# Altium project ThermalTiny.PrjPcb
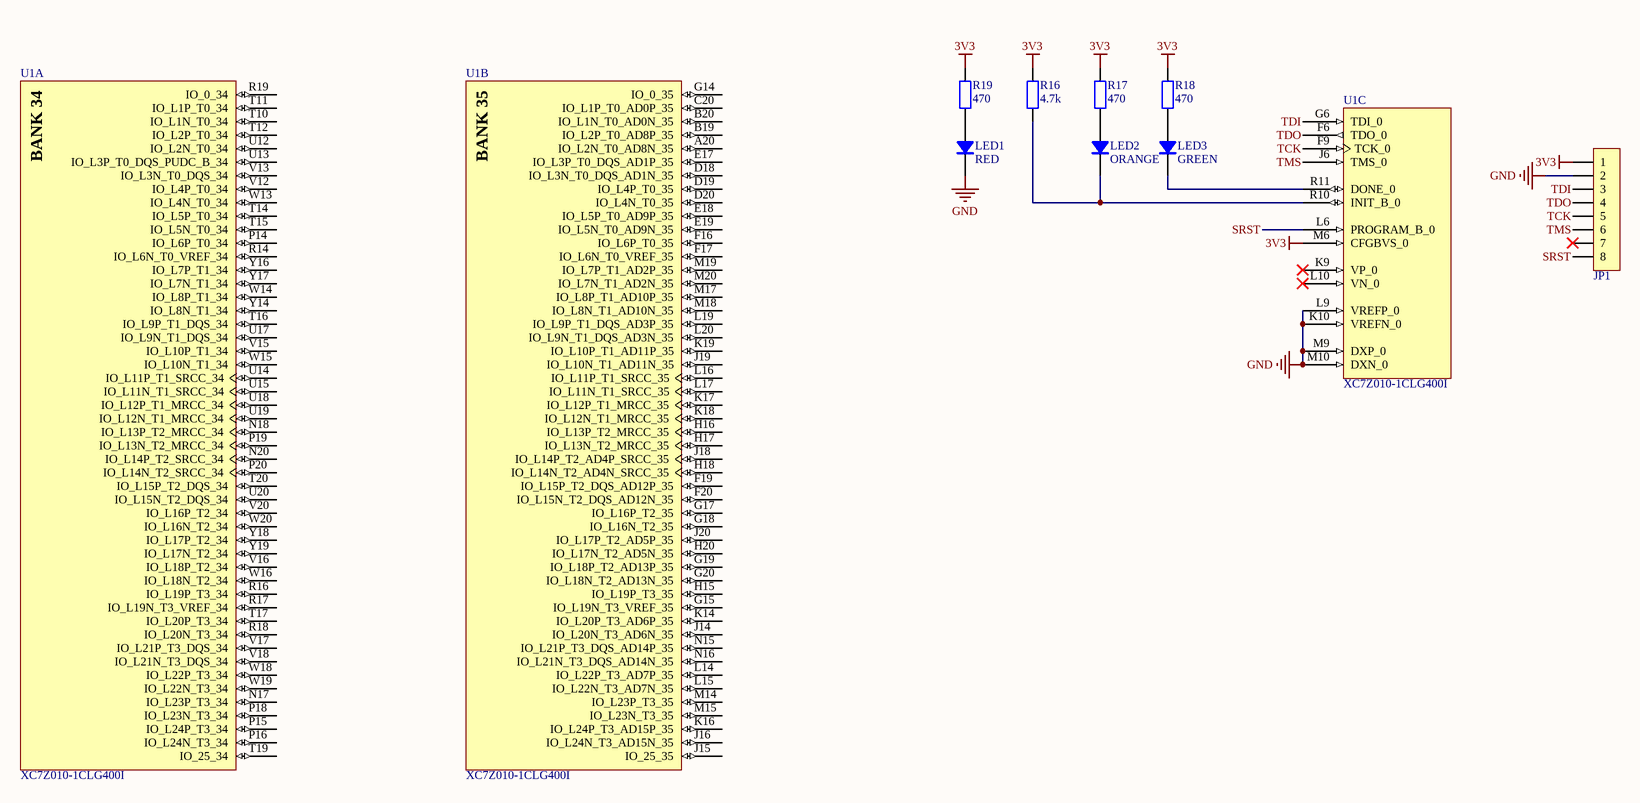
[diagram p0: FPGA_Banks.SchDoc]
5 sheets, 78 parts. Net scope: global (net labels, ports and power ports of the same name join across sheets).
Board file: PCB3.PcbDoc
Sheets:
  FPGA_Banks.SchDoc
  FPGA_PowerConnection.SchDoc
  FPGA_PSIO.SchDoc
  Power_Supply.SchDoc
  Data_Collector.SchDoc

## Sheet FPGA_Banks.SchDoc
size A3; SheetNumber: 1; SheetTotal: 5

### Parts
JP1  HDR-1X8  [HDR2.54-LI-8P]  (value not drawn)
LED1  RED  [LED 0603R]
LED2  ORANGE  [LED 0603Y]
LED3  GREEN  [LED 0603G]
R16  4.7k  [R0402]
R17  470  [R0402]
R18  470  [R0402]
R19  470  [R0402]
U1  XC7Z010-1CLG400I  [CLG400]  (parts A,B,C of 9)

### Nets
3V3: JP1.1 R16.1 R17.1 R18.1 R19.1 U1.M6(CFGBVS_0)
GND: JP1.2 LED1.2(K) U1.K10(VREFN_0) U1.L9(VREFP_0) U1.M9(DXP_0) U1.M10(DXN_0)
SRST: JP1.8 U1.L6(PROGRAM_B_0)
TCK: JP1.5 U1.F9(TCK_0)
TDI: JP1.3 U1.G6(TDI_0)
TDO: JP1.4 U1.F6(TDO_0)
TMS: JP1.6 U1.J6(TMS_0)
NetLED1_1: LED1.1(A) R19.2
NetLED2_1: LED2.1(A) R17.2
NetLED2_2: LED2.2(K) R16.2 U1.R10(INIT_B_0)
NetLED3_1: LED3.1(A) R18.2
NetLED3_2: LED3.2(K) U1.R11(DONE_0)

Not connected (* = marked no-connect by the designer): JP1 7*; U1 A20(IO_L2N_T0_AD8N_35) B19(IO_L2P_T0_AD8P_35) B20(IO_L1N_T0_AD0N_35) C20(IO_L1P_T0_AD0P_35) D18(IO_L3N_T0_DQS_AD1N_35) D19(IO_L4P_T0_35) D20(IO_L4N_T0_35) E17(IO_L3P_T0_DQS_AD1P_35) E18(IO_L5P_T0_AD9P_35) E19(IO_L5N_T0_AD9N_35) F16(IO_L6P_T0_35) F17(IO_L6N_T0_VREF_35) F19(IO_L15P_T2_DQS_AD12P_35) F20(IO_L15N_T2_DQS_AD12N_35) G14(IO_0_35) G15(IO_L19N_T3_VREF_35) G17(IO_L16P_T2_35) G18(IO_L16N_T2_35) G19(IO_L18P_T2_AD13P_35) G20(IO_L18N_T2_AD13N_35) H15(IO_L19P_T3_35) H16(IO_L13P_T2_MRCC_35) H17(IO_L13N_T2_MRCC_35) H18(IO_L14N_T2_AD4N_SRCC_35) H20(IO_L17N_T2_AD5N_35) J14(IO_L20N_T3_AD6N_35) J15(IO_25_35) J16(IO_L24N_T3_AD15N_35) J18(IO_L14P_T2_AD4P_SRCC_35) J19(IO_L10N_T1_AD11N_35) J20(IO_L17P_T2_AD5P_35) K9(VP_0)* K14(IO_L20P_T3_AD6P_35) K16(IO_L24P_T3_AD15P_35) K17(IO_L12P_T1_MRCC_35) K18(IO_L12N_T1_MRCC_35) K19(IO_L10P_T1_AD11P_35) L10(VN_0)* L14(IO_L22P_T3_AD7P_35) L15(IO_L22N_T3_AD7N_35) L16(IO_L11P_T1_SRCC_35) L17(IO_L11N_T1_SRCC_35) L19(IO_L9P_T1_DQS_AD3P_35) L20(IO_L9N_T1_DQS_AD3N_35) M14(IO_L23P_T3_35) M15(IO_L23N_T3_35) M17(IO_L8P_T1_AD10P_35) M18(IO_L8N_T1_AD10N_35) M19(IO_L7P_T1_AD2P_35) M20(IO_L7N_T1_AD2N_35) N15(IO_L21P_T3_DQS_AD14P_35) N16(IO_L21N_T3_DQS_AD14N_35) N17(IO_L23P_T3_34) N18(IO_L13P_T2_MRCC_34) N20(IO_L14P_T2_SRCC_34) P14(IO_L6P_T0_34) P15(IO_L24P_T3_34) P16(IO_L24N_T3_34) P18(IO_L23N_T3_34) P19(IO_L13N_T2_MRCC_34) P20(IO_L14N_T2_SRCC_34) R14(IO_L6N_T0_VREF_34) R16(IO_L19P_T3_34) R17(IO_L19N_T3_VREF_34) R18(IO_L20N_T3_34) R19(IO_0_34) T10(IO_L1N_T0_34) T11(IO_L1P_T0_34) T12(IO_L2P_T0_34) T14(IO_L5P_T0_34) T15(IO_L5N_T0_34) T16(IO_L9P_T1_DQS_34) T17(IO_L20P_T3_34) T19(IO_25_34) T20(IO_L15P_T2_DQS_34) U12(IO_L2N_T0_34) U13(IO_L3P_T0_DQS_PUDC_B_34) U14(IO_L11P_T1_SRCC_34) U15(IO_L11N_T1_SRCC_34) U17(IO_L9N_T1_DQS_34) U18(IO_L12P_T1_MRCC_34) U19(IO_L12N_T1_MRCC_34) U20(IO_L15N_T2_DQS_34) V12(IO_L4P_T0_34) V13(IO_L3N_T0_DQS_34) V15(IO_L10P_T1_34) V16(IO_L18P_T2_34) V17(IO_L21P_T3_DQS_34) V18(IO_L21N_T3_DQS_34) V20(IO_L16P_T2_34) W13(IO_L4N_T0_34) W14(IO_L8P_T1_34) W15(IO_L10N_T1_34) W16(IO_L18N_T2_34) W18(IO_L22P_T3_34) W19(IO_L22N_T3_34) W20(IO_L16N_T2_34) Y14(IO_L8N_T1_34) Y16(IO_L7P_T1_34) Y17(IO_L7N_T1_34) Y18(IO_L17P_T2_34) Y19(IO_L17N_T2_34)

### Notes on the sheet
- (in symbol CMP-0363-00008-3, part A) BANK 34
- (in symbol CMP-0363-00008-3, part B) BANK 35

### Library data of the parts
JP1 = Header 8: 8P接插件; 版权归属: 源创客; BOM名称: 8P接插件; 学习资源: www.ooocke.com
LED1-LED3 = D
R16-R19 = R
U1 = CMP-0363-00008-3: 667 MHz Zynq™-7000 AP SoC, 130 PS I/O, 100 FPGA I/O, 400-Ball BGA, Speed Grade 1, Industrial Grade, Pb-Free; Speed Grade: -1; LUTs: 17600; Extensible Block RAM (# 36Kb Blocks): 240 KB (60); Flip Flops: 35200; PartNumber: XC7Z010-1CLG400I; Mounting Technology: Surface Mount; ComponentLink5URL: http://www.xilinx.com/support/documentation/user_guides/ug865-Zynq-7000-Pkg-Pinout.pdf; ComponentLink3URL: http://www.xilinx.com/support/documentation/data_sheets/ds187-XC7Z010-XC7Z020-Data-Sheet.pdf; PackageVersion: Rev 1.1, 09/2012; ComponentLink2Description: Package Specification; ComponentLink4Description: Package File; ComponentLink2URL: http://www.xilinx.com/support/documentation/user_guides/ug865-Zynq-7000-Pkg-Pinout.pdf; ComponentLink3Description: DC and AC Switching Characteristics; ComponentLink6Description: PCB and Layout Guide; ComponentLink4URL: http://www.xilinx.com/support/packagefiles/z7packages/xc7z010clg400pkg.txt; ComponentLink1URL: http://www.xilinx.com/support/documentation/data_sheets/ds190-Zynq-7000-Overview.pdf; Generic Part Number: XC7Z010; PackageReference: CLG400; ComponentLink1Description: Datasheet; RoHS: Pb-Free; ComponentLink6URL: http://www.xilinx.com/support/documentation/user_guides/ug483_7Series_PCB.pdf; DatasheetVersion: v1.2; PackageDescription: Wire-Bond Chip-Scale BGA, Body 17 x 17 mm, 0.8 mm Pitch; ComponentLink5Description: Packaging and Pinout; Code_JEDEC: MO-275-MMAA-1

## Sheet FPGA_PowerConnection.SchDoc
size A3; SheetNumber: 2; SheetTotal: 5
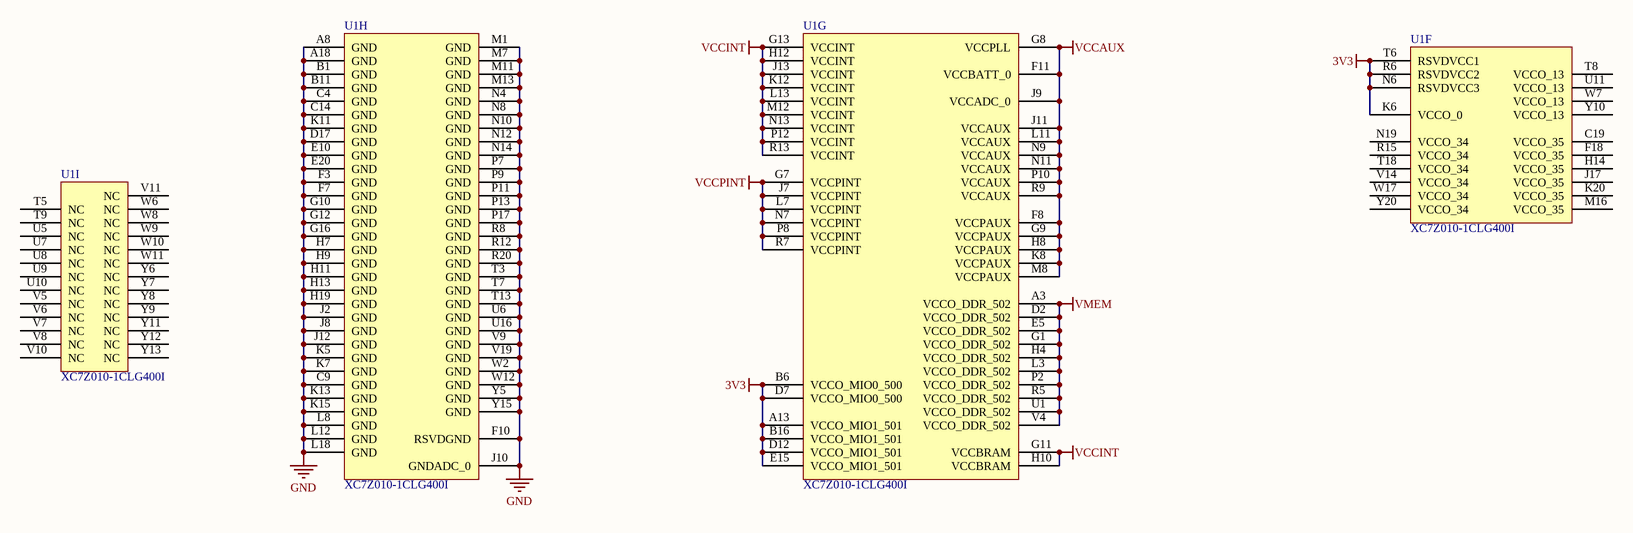
[diagram p1: FPGA_PowerConnection.SchDoc]

### Parts
U1  XC7Z010-1CLG400I  [CLG400]  (parts F,G,H,I of 9)

### Nets
3V3: U1.A13(VCCO_MIO1_501) U1.B6(VCCO_MIO0_500) U1.B16(VCCO_MIO1_501) U1.D7(VCCO_MIO0_500) U1.D12(VCCO_MIO1_501) U1.E15(VCCO_MIO1_501) U1.K6(VCCO_0) U1.N6(RSVDVCC3) U1.R6(RSVDVCC2) U1.T6(RSVDVCC1)
GND: U1.A8(GND) U1.A18(GND) U1.B1(GND) U1.B11(GND) U1.C4(GND) U1.C9(GND) U1.C14(GND) U1.D17(GND) U1.E10(GND) U1.E20(GND) U1.F3(GND) U1.F7(GND) U1.F10(RSVDGND) U1.G10(GND) U1.G12(GND) U1.G16(GND) U1.H7(GND) U1.H9(GND) U1.H11(GND) U1.H13(GND) U1.H19(GND) U1.J2(GND) U1.J8(GND) U1.J10(GNDADC_0) U1.J12(GND) U1.K5(GND) U1.K7(GND) U1.K11(GND) U1.K13(GND) U1.K15(GND) U1.L8(GND) U1.L12(GND) U1.L18(GND) U1.M1(GND) U1.M7(GND) U1.M11(GND) U1.M13(GND) U1.N4(GND) U1.N8(GND) U1.N10(GND) U1.N12(GND) U1.N14(GND) U1.P7(GND) U1.P9(GND) U1.P11(GND) U1.P13(GND) U1.P17(GND) U1.R8(GND) U1.R12(GND) U1.R20(GND) U1.T3(GND) U1.T7(GND) U1.T13(GND) U1.U6(GND) U1.U16(GND) U1.V9(GND) U1.V19(GND) U1.W2(GND) U1.W12(GND) U1.Y5(GND) U1.Y15(GND)
VCCAUX: U1.F8(VCCPAUX) U1.F11(VCCBATT_0) U1.G8(VCCPLL) U1.G9(VCCPAUX) U1.H8(VCCPAUX) U1.J9(VCCADC_0) U1.J11(VCCAUX) U1.K8(VCCPAUX) U1.L11(VCCAUX) U1.M8(VCCPAUX) U1.N9(VCCAUX) U1.N11(VCCAUX) U1.P10(VCCAUX) U1.R9(VCCAUX)
VCCINT: U1.G11(VCCBRAM) U1.G13(VCCINT) U1.H10(VCCBRAM) U1.H12(VCCINT) U1.J13(VCCINT) U1.K12(VCCINT) U1.L13(VCCINT) U1.M12(VCCINT) U1.N13(VCCINT) U1.P12(VCCINT) U1.R13(VCCINT)
VCCPINT: U1.G7(VCCPINT) U1.J7(VCCPINT) U1.L7(VCCPINT) U1.N7(VCCPINT) U1.P8(VCCPINT) U1.R7(VCCPINT)
VMEM: U1.A3(VCCO_DDR_502) U1.D2(VCCO_DDR_502) U1.E5(VCCO_DDR_502) U1.G1(VCCO_DDR_502) U1.H4(VCCO_DDR_502) U1.L3(VCCO_DDR_502) U1.P2(VCCO_DDR_502) U1.R5(VCCO_DDR_502) U1.U1(VCCO_DDR_502) U1.V4(VCCO_DDR_502)

Not connected (* = marked no-connect by the designer): U1 C19(VCCO_35) F18(VCCO_35) H14(VCCO_35) J17(VCCO_35) K20(VCCO_35) M16(VCCO_35) N19(VCCO_34) R15(VCCO_34) T5(NC) T8(VCCO_13) T9(NC) T18(VCCO_34) U5(NC) U7(NC) U8(NC) U9(NC) U10(NC) U11(VCCO_13) V5(NC) V6(NC) V7(NC) V8(NC) V10(NC) V11(NC) V14(VCCO_34) W6(NC) W7(VCCO_13) W8(NC) W9(NC) W10(NC) W11(NC) W17(VCCO_34) Y6(NC) Y7(NC) Y8(NC) Y9(NC) Y10(VCCO_13) Y11(NC) Y12(NC) Y13(NC) Y20(VCCO_34)

### Library data of the parts
U1 = CMP-0363-00008-3: as U1 on sheet FPGA_Banks; PartNumber: XC7Z010-1CLG400I; Mounting Technology: Surface Mount; ComponentLink5URL: http://www.xilinx.com/support/documentation/user_guides/ug865-Zynq-7000-Pkg-Pinout.pdf; ComponentLink3URL: http://www.xilinx.com/support/documentation/data_sheets/ds187-XC7Z010-XC7Z020-Data-Sheet.pdf; PackageVersion: Rev 1.1, 09/2012; ComponentLink2Description: Package Specification; ComponentLink4Description: Package File; ComponentLink2URL: http://www.xilinx.com/support/documentation/user_guides/ug865-Zynq-7000-Pkg-Pinout.pdf; ComponentLink3Description: DC and AC Switching Characteristics; ComponentLink6Description: PCB and Layout Guide; ComponentLink4URL: http://www.xilinx.com/support/packagefiles/z7packages/xc7z010clg400pkg.txt; ComponentLink1URL: http://www.xilinx.com/support/documentation/data_sheets/ds190-Zynq-7000-Overview.pdf; Generic Part Number: XC7Z010; PackageReference: CLG400; ComponentLink1Description: Datasheet; RoHS: Pb-Free; ComponentLink6URL: http://www.xilinx.com/support/documentation/user_guides/ug483_7Series_PCB.pdf; DatasheetVersion: v1.2; PackageDescription: Wire-Bond Chip-Scale BGA, Body 17 x 17 mm, 0.8 mm Pitch; ComponentLink5Description: Packaging and Pinout; Code_JEDEC: MO-275-MMAA-1

## Sheet FPGA_PSIO.SchDoc
size A3; SheetNumber: 3; SheetTotal: 5
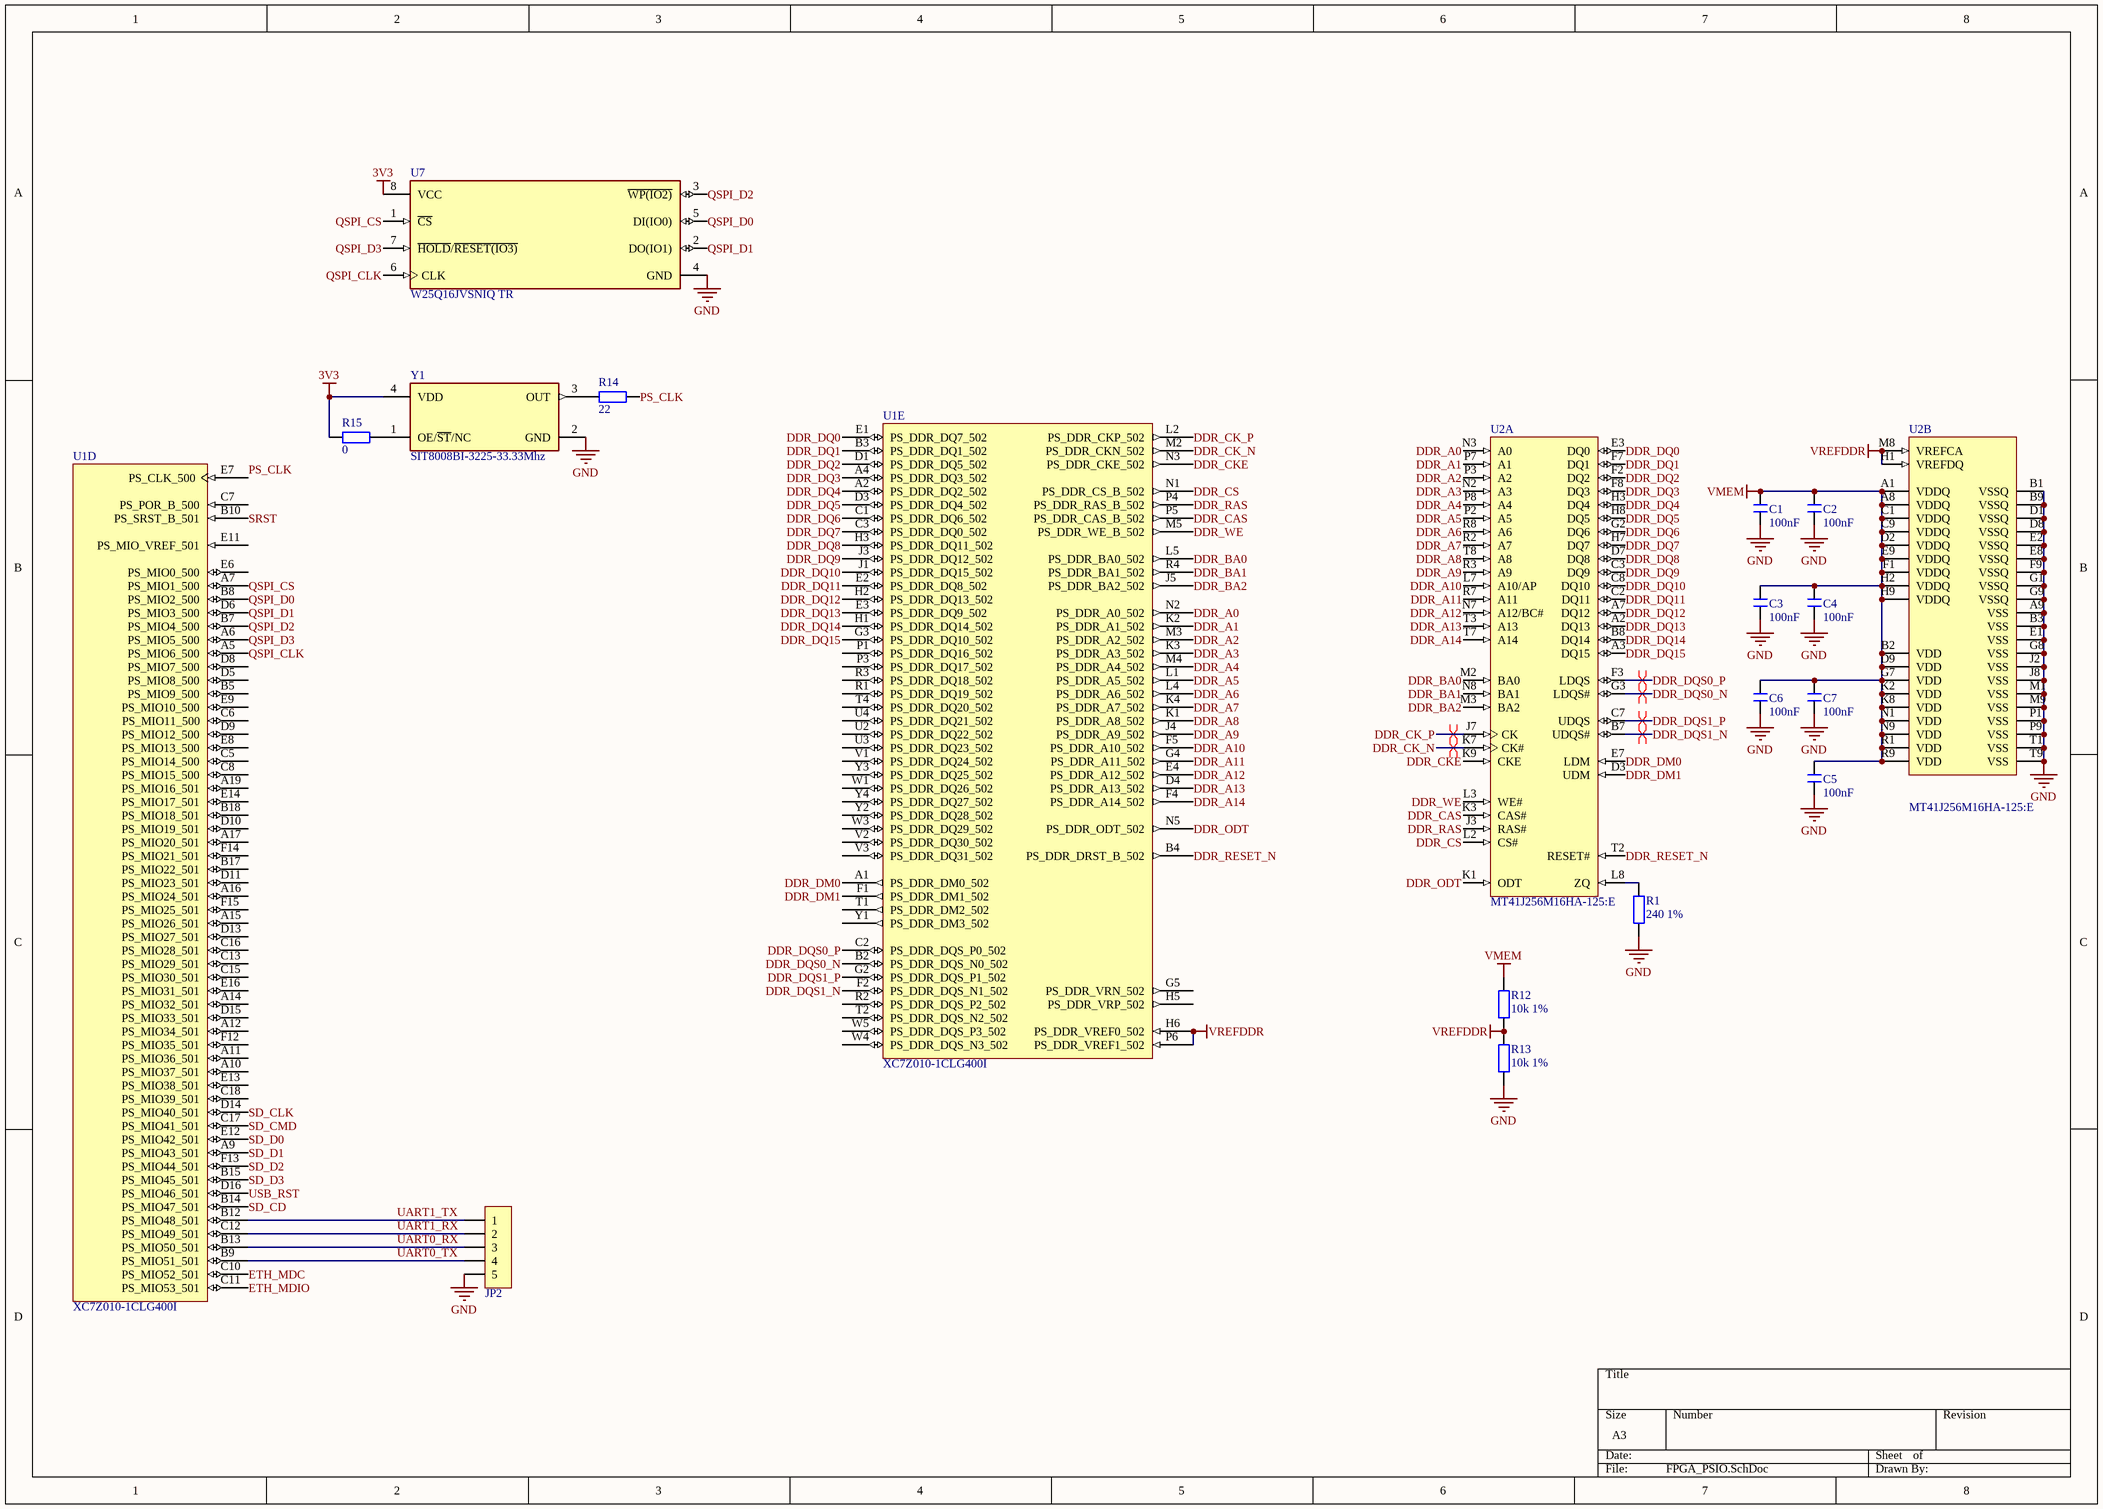
[diagram p2: FPGA_PSIO.SchDoc]

### Parts
C1  100nF  [C0402]
C2  100nF  [C0402]
C3  100nF  [C0402]
C4  100nF  [C0402]
C5  100nF  [C0402]
C6  100nF  [C0402]
C7  100nF  [C0402]
JP2  HDR-1X5  [HDR2.54-LI-5P]  (value not drawn)
R1  240 1%  [R0603]
R12  10k 1%  [R0402]
R13  10k 1%  [R0402]
R14  22  [R0402]
R15  0  [R0402]
U1  XC7Z010-1CLG400I  [CLG400]  (parts D,E of 9)
U2  MT41J256M16HA-125:E  [MICT-HA-96]  (parts A,B of 3)
U7  W25Q16JVSNIQ TR  [FP-SN-MFG]
Y1  SIT8008BI-3225-33.33Mhz  [FP-SiT8008-2-MFG]

### Nets
3V3: R15.1 U7.8(VCC) Y1.4(VDD)
GND: C1.2 C2.2 C3.2 C4.2 C5.2 C6.2 C7.2 JP2.5 R1.1 R13.1 U2.A9(VSS) U2.B1(VSSQ) U2.B3(VSS) U2.B9(VSSQ) U2.D1(VSSQ) U2.D8(VSSQ) U2.E1(VSS) U2.E2(VSSQ) U2.E8(VSSQ) U2.F9(VSSQ) U2.G1(VSSQ) U2.G8(VSS) U2.G9(VSSQ) U2.J2(VSS) U2.J8(VSS) U2.M1(VSS) U2.M9(VSS) U2.P1(VSS) U2.P9(VSS) U2.T1(VSS) U2.T9(VSS) U7.4(GND) Y1.2(GND)
VMEM: C1.1 C2.1 C3.1 C4.1 C5.1 C6.1 C7.1 R12.2 U2.A1(VDDQ) U2.A8(VDDQ) U2.B2(VDD) U2.C1(VDDQ) U2.C9(VDDQ) U2.D2(VDDQ) U2.D9(VDD) U2.E9(VDDQ) U2.F1(VDDQ) U2.G7(VDD) U2.H2(VDDQ) U2.H9(VDDQ) U2.K2(VDD) U2.K8(VDD) U2.N1(VDD) U2.N9(VDD) U2.R1(VDD) U2.R9(VDD)
VREFDDR: R12.1 R13.2 U1.H6(PS_DDR_VREF0_502) U1.P6(PS_DDR_VREF1_502) U2.H1(VREFDQ) U2.M8(VREFCA)
DDR_A0: U1.N2(PS_DDR_A0_502) U2.N3(A0)
DDR_A1: U1.K2(PS_DDR_A1_502) U2.P7(A1)
DDR_A2: U1.M3(PS_DDR_A2_502) U2.P3(A2)
DDR_A3: U1.K3(PS_DDR_A3_502) U2.N2(A3)
DDR_A4: U1.M4(PS_DDR_A4_502) U2.P8(A4)
DDR_A5: U1.L1(PS_DDR_A5_502) U2.P2(A5)
DDR_A6: U1.L4(PS_DDR_A6_502) U2.R8(A6)
DDR_A7: U1.K4(PS_DDR_A7_502) U2.R2(A7)
DDR_A8: U1.K1(PS_DDR_A8_502) U2.T8(A8)
DDR_A9: U1.J4(PS_DDR_A9_502) U2.R3(A9)
DDR_A10: U1.F5(PS_DDR_A10_502) U2.L7(A10/AP)
DDR_A11: U1.G4(PS_DDR_A11_502) U2.R7(A11)
DDR_A12: U1.E4(PS_DDR_A12_502) U2.N7(A12/BC#)
DDR_A13: U1.D4(PS_DDR_A13_502) U2.T3(A13)
DDR_A14: U1.F4(PS_DDR_A14_502) U2.T7(A14)
DDR_BA0: U1.L5(PS_DDR_BA0_502) U2.M2(BA0)
DDR_BA1: U1.R4(PS_DDR_BA1_502) U2.N8(BA1)
DDR_BA2: U1.J5(PS_DDR_BA2_502) U2.M3(BA2)
DDR_CAS: U1.P5(PS_DDR_CAS_B_502) U2.K3(CAS#)
DDR_CK_N: U1.M2(PS_DDR_CKN_502) U2.K7(CK#)
DDR_CK_P: U1.L2(PS_DDR_CKP_502) U2.J7(CK)
DDR_CKE: U1.N3(PS_DDR_CKE_502) U2.K9(CKE)
DDR_CS: U1.N1(PS_DDR_CS_B_502) U2.L2(CS#)
DDR_DM0: U1.A1(PS_DDR_DM0_502) U2.E7(LDM)
DDR_DM1: U1.F1(PS_DDR_DM1_502) U2.D3(UDM)
DDR_DQ0: U1.E1(PS_DDR_DQ7_502) U2.E3(DQ0)
DDR_DQ1: U1.B3(PS_DDR_DQ1_502) U2.F7(DQ1)
DDR_DQ2: U1.D1(PS_DDR_DQ5_502) U2.F2(DQ2)
DDR_DQ3: U1.A4(PS_DDR_DQ3_502) U2.F8(DQ3)
DDR_DQ4: U1.A2(PS_DDR_DQ2_502) U2.H3(DQ4)
DDR_DQ5: U1.D3(PS_DDR_DQ4_502) U2.H8(DQ5)
DDR_DQ6: U1.C1(PS_DDR_DQ6_502) U2.G2(DQ6)
DDR_DQ7: U1.C3(PS_DDR_DQ0_502) U2.H7(DQ7)
DDR_DQ8: U1.H3(PS_DDR_DQ11_502) U2.D7(DQ8)
DDR_DQ9: U1.J3(PS_DDR_DQ12_502) U2.C3(DQ9)
DDR_DQ10: U1.J1(PS_DDR_DQ15_502) U2.C8(DQ10)
DDR_DQ11: U1.E2(PS_DDR_DQ8_502) U2.C2(DQ11)
DDR_DQ12: U1.H2(PS_DDR_DQ13_502) U2.A7(DQ12)
DDR_DQ13: U1.E3(PS_DDR_DQ9_502) U2.A2(DQ13)
DDR_DQ14: U1.H1(PS_DDR_DQ14_502) U2.B8(DQ14)
DDR_DQ15: U1.G3(PS_DDR_DQ10_502) U2.A3(DQ15)
DDR_DQS0_N: U1.B2(PS_DDR_DQS_N0_502) U2.G3(LDQS#)
DDR_DQS0_P: U1.C2(PS_DDR_DQS_P0_502) U2.F3(LDQS)
DDR_DQS1_N: U1.F2(PS_DDR_DQS_N1_502) U2.B7(UDQS#)
DDR_DQS1_P: U1.G2(PS_DDR_DQS_P1_502) U2.C7(UDQS)
DDR_ODT: U1.N5(PS_DDR_ODT_502) U2.K1(ODT)
DDR_RAS: U1.P4(PS_DDR_RAS_B_502) U2.J3(RAS#)
DDR_RESET_N: U1.B4(PS_DDR_DRST_B_502) U2.T2(RESET#)
DDR_WE: U1.M5(PS_DDR_WE_B_502) U2.L3(WE#)
ETH_MDC: U1.C10(PS_MIO52_501)
ETH_MDIO: U1.C11(PS_MIO53_501)
PS_CLK: R14.1 U1.E7(PS_CLK_500)
QSPI_CLK: U1.A5(PS_MIO6_500) U7.6(CLK)
QSPI_CS: U1.A7(PS_MIO1_500) U7.1(~{CS})
QSPI_D0: U1.B8(PS_MIO2_500) U7.5(DI(IO0))
QSPI_D1: U1.D6(PS_MIO3_500) U7.2(DO(IO1))
QSPI_D2: U1.B7(PS_MIO4_500) U7.3(~{WP(IO2)})
QSPI_D3: U1.A6(PS_MIO5_500) U7.7(~{HOLD}/~{RESET(IO3)})
SD_CD: U1.B14(PS_MIO47_501)
SD_CLK: U1.D14(PS_MIO40_501)
SD_CMD: U1.C17(PS_MIO41_501)
SD_D0: U1.E12(PS_MIO42_501)
SD_D1: U1.A9(PS_MIO43_501)
SD_D2: U1.F13(PS_MIO44_501)
SD_D3: U1.B15(PS_MIO45_501)
SRST: U1.B10(PS_SRST_B_501)
UART0_RX: JP2.3 U1.B13(PS_MIO50_501)
UART0_TX: JP2.4 U1.B9(PS_MIO51_501)
UART1_RX: JP2.2 U1.C12(PS_MIO49_501)
UART1_TX: JP2.1 U1.B12(PS_MIO48_501)
USB_RST: U1.D16(PS_MIO46_501)
NetR1_2: R1.2 U2.L8(ZQ)
NetR14_2: R14.2 Y1.3(OUT)
NetR15_2: R15.2 Y1.1(OE/~{ST}/NC)

Not connected (* = marked no-connect by the designer): U1 A10(PS_MIO37_501) A11(PS_MIO36_501) A12(PS_MIO34_501) A14(PS_MIO32_501) A15(PS_MIO26_501) A16(PS_MIO24_501) A17(PS_MIO20_501) A19(PS_MIO16_501) B5(PS_MIO9_500) B17(PS_MIO22_501) B18(PS_MIO18_501) C5(PS_MIO14_500) C6(PS_MIO11_500) C7(PS_POR_B_500) C8(PS_MIO15_500) C13(PS_MIO29_501) C15(PS_MIO30_501) C16(PS_MIO28_501) C18(PS_MIO39_501) D5(PS_MIO8_500) D8(PS_MIO7_500) D9(PS_MIO12_500) D10(PS_MIO19_501) D11(PS_MIO23_501) D13(PS_MIO27_501) D15(PS_MIO33_501) E6(PS_MIO0_500) E8(PS_MIO13_500) E9(PS_MIO10_500) E11(PS_MIO_VREF_501) E13(PS_MIO38_501) E14(PS_MIO17_501) E16(PS_MIO31_501) F12(PS_MIO35_501) F14(PS_MIO21_501) F15(PS_MIO25_501) G5(PS_DDR_VRN_502) H5(PS_DDR_VRP_502) P1(PS_DDR_DQ16_502) P3(PS_DDR_DQ17_502) R1(PS_DDR_DQ19_502) R2(PS_DDR_DQS_P2_502) R3(PS_DDR_DQ18_502) T1(PS_DDR_DM2_502) T2(PS_DDR_DQS_N2_502) T4(PS_DDR_DQ20_502) U2(PS_DDR_DQ22_502) U3(PS_DDR_DQ23_502) U4(PS_DDR_DQ21_502) V1(PS_DDR_DQ24_502) V2(PS_DDR_DQ30_502) V3(PS_DDR_DQ31_502) W1(PS_DDR_DQ26_502) W3(PS_DDR_DQ29_502) W4(PS_DDR_DQS_N3_502) W5(PS_DDR_DQS_P3_502) Y1(PS_DDR_DM3_502) Y2(PS_DDR_DQ28_502) Y3(PS_DDR_DQ25_502) Y4(PS_DDR_DQ27_502)

### Layout directives
differential pair: DDR_CK_N, DDR_CK_P, DDR_DQS0_N, DDR_DQS0_P, DDR_DQS1_N, DDR_DQS1_P

### Library data of the parts
C1-C7 = C
JP2 = Header 5: 5P接插件; 版权归属: 源创客; BOM名称: 5P接插件; 学习资源: www.ooocke.com
R1 R12-R15 = R
U1 = CMP-0363-00008-3: as U1 on sheet FPGA_Banks; PartNumber: XC7Z010-1CLG400I; Mounting Technology: Surface Mount; ComponentLink5URL: http://www.xilinx.com/support/documentation/user_guides/ug865-Zynq-7000-Pkg-Pinout.pdf; ComponentLink3URL: http://www.xilinx.com/support/documentation/data_sheets/ds187-XC7Z010-XC7Z020-Data-Sheet.pdf; PackageVersion: Rev 1.1, 09/2012; ComponentLink2Description: Package Specification; ComponentLink4Description: Package File; ComponentLink2URL: http://www.xilinx.com/support/documentation/user_guides/ug865-Zynq-7000-Pkg-Pinout.pdf; ComponentLink3Description: DC and AC Switching Characteristics; ComponentLink6Description: PCB and Layout Guide; ComponentLink4URL: http://www.xilinx.com/support/packagefiles/z7packages/xc7z010clg400pkg.txt; ComponentLink1URL: http://www.xilinx.com/support/documentation/data_sheets/ds190-Zynq-7000-Overview.pdf; Generic Part Number: XC7Z010; PackageReference: CLG400; ComponentLink1Description: Datasheet; RoHS: Pb-Free; ComponentLink6URL: http://www.xilinx.com/support/documentation/user_guides/ug483_7Series_PCB.pdf; DatasheetVersion: v1.2; PackageDescription: Wire-Bond Chip-Scale BGA, Body 17 x 17 mm, 0.8 mm Pitch; ComponentLink5Description: Packaging and Pinout; Code_JEDEC: MO-275-MMAA-1
U2 = CMP-2000-04968-1: 4 Gb DDR3-1600 SDRAM, 256 Mb x 16, 1.25 ns, 1.5 V, 0 to 95 degC, 96-Ball FBGA, Pb-Free; Manufacturer: Micron; Operating Supply Voltage: 1.5V; Address Bus Width: 18Bit; Density: 4Gb; Data Bus Width: 16Bit; Maximum Clock Rate: 1600MHz; Rad Hard: No; Package: 96FBGA; Operating Temperature: 0to95degC; Package Description: 96-Ball Fine-Pitch Ball Grid Array, Body 14 x 9 mm, Pitch 0.8 mm; Package Reference: HA-96; Manufacturer URL: https://www.micron.com/; Datasheet URL: http://passthrough.fw-notify.net/download/888500/http://download.siliconexpert.com/pdfs/2013/4/14/9/8/34/442/mic_/manual/234gb_ddr3_sdram.pdf; Datasheet Version: Rev. M, 04/2013; Number of Bits per Word: 16Bit; Type: DDR3SDRAM
U7 = CMP-78876-000009-1: IC FLASH 16MBIT SPI/QUAD 8SOIC; Memory Size: 16Mb; Frequency: 133MHz; Memory Type: Non-Volatile; Case/Package: SOIC; Series: SpiFlash®; Max Operating Temperature: 85°C; Packaging: Tape and Reel; Min Operating Temperature: -40°C; Mount: Surface Mount
Y1 = CMP-25159-264104-1: Oscillator MEMS 1MHz to 110MHz ±20ppm (Stability) LVCMOS 2.5V/2.8V/3V/3.3V Medical 4-Pin QFN SMD T/R

## Sheet Power_Supply.SchDoc
size A3; SheetNumber: 4; SheetTotal: 5
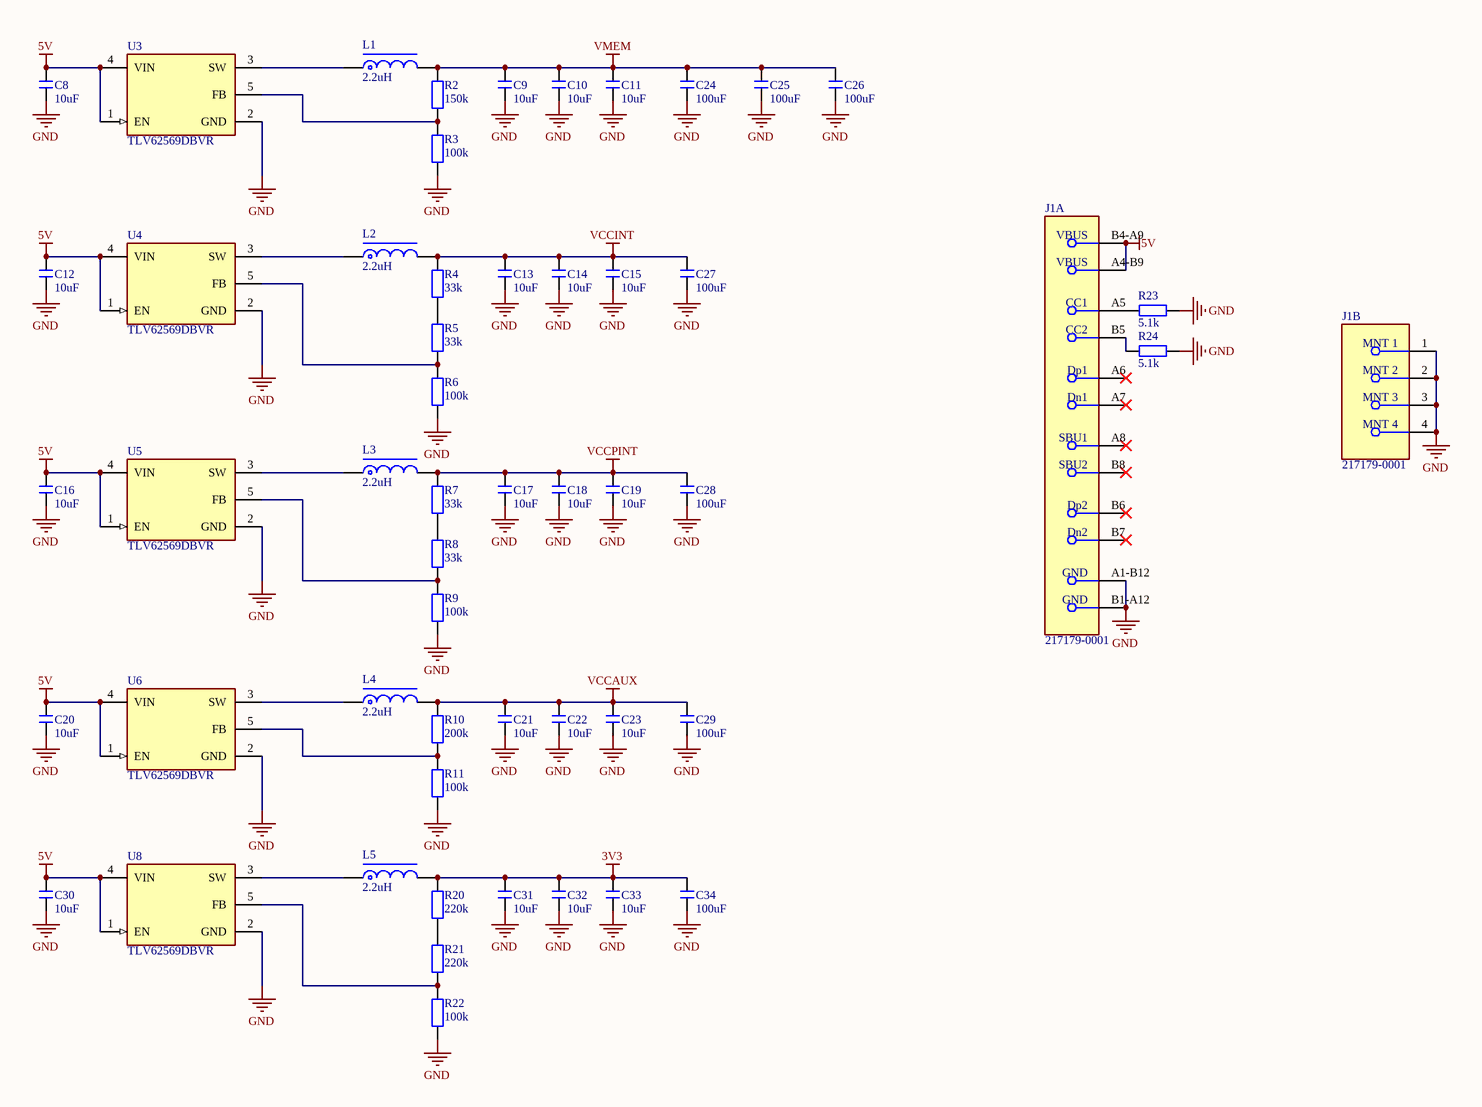
[diagram p3: Power_Supply.SchDoc]

### Parts
C8  10uF  [C0603]
C9  10uF  [C0603]
C10  10uF  [C0603]
C11  10uF  [C0603]
C12  10uF  [C0603]
C13  10uF  [C0603]
C14  10uF  [C0603]
C15  10uF  [C0603]
C16  10uF  [C0603]
C17  10uF  [C0603]
C18  10uF  [C0603]
C19  10uF  [C0603]
C20  10uF  [C0603]
C21  10uF  [C0603]
C22  10uF  [C0603]
C23  10uF  [C0603]
C24  100uF  [C1206]
C25  100uF  [C1206]
C26  100uF  [C1206]
C27  100uF  [C1206]
C28  100uF  [C1206]
C29  100uF  [C1206]
C30  10uF  [C0603]
C31  10uF  [C0603]
C32  10uF  [C0603]
C33  10uF  [C0603]
C34  100uF  [C1206]
J1  217179-0001  [FP-217179-0001-MFG]  (parts A,B of 2)
L1  2.2uH  [CD31]
L2  2.2uH  [CD31]
L3  2.2uH  [CD31]
L4  2.2uH  [CD31]
L5  2.2uH  [CD31]
R2  150k  [R0603]
R3  100k  [R0603]
R4  33k  [R0402]
R5  33k  [R0402]
R6  100k  [R0603]
R7  33k  [R0402]
R8  33k  [R0402]
R9  100k  [R0603]
R10  200k  [R0603]
R11  100k  [R0603]
R20  220k  [R0402]
R21  220k  [R0402]
R22  100k  [R0603]
R23  5.1k  [R0402]
R24  5.1k  [R0402]
U3  TLV62569DBVR  [FP-DBV0005A-MFG]
U4  TLV62569DBVR  [FP-DBV0005A-MFG]
U5  TLV62569DBVR  [FP-DBV0005A-MFG]
U6  TLV62569DBVR  [FP-DBV0005A-MFG]
U8  TLV62569DBVR  [FP-DBV0005A-MFG]

### Nets
3V3: C31.1 C32.1 C33.1 C34.1 L5.2 R20.2
5V: C8.1 C12.1 C16.1 C20.1 C30.1 J1.A4-B9(VBUS) J1.B4-A9(VBUS) U3.1(EN) U3.4(VIN) U4.1(EN) U4.4(VIN) U5.1(EN) U5.4(VIN) U6.1(EN) U6.4(VIN) U8.1(EN) U8.4(VIN)
GND: C8.2 C9.2 C10.2 C11.2 C12.2 C13.2 C14.2 C15.2 C16.2 C17.2 C18.2 C19.2 C20.2 C21.2 C22.2 C23.2 C24.2 C25.2 C26.2 C27.2 C28.2 C29.2 C30.2 C31.2 C32.2 C33.2 C34.2 J1.1(MNT_1) J1.2(MNT_2) J1.3(MNT_3) J1.4(MNT_4) J1.A1-B12(GND) J1.B1-A12(GND) R3.1 R6.1 R9.1 R11.1 R22.1 R23.1 R24.1 U3.2(GND) U4.2(GND) U5.2(GND) U6.2(GND) U8.2(GND)
VCCAUX: C21.1 C22.1 C23.1 C29.1 L4.2 R10.2
VCCINT: C13.1 C14.1 C15.1 C27.1 L2.2 R4.2
VCCPINT: C17.1 C18.1 C19.1 C28.1 L3.2 R7.2
VMEM: C9.1 C10.1 C11.1 C24.1 C25.1 C26.1 L1.2 R2.2
NetJ1_A5: J1.A5(CC1) R23.2
NetJ1_B5: J1.B5(CC2) R24.2
NetL1_1: L1.1 U3.3(SW)
NetL2_1: L2.1 U4.3(SW)
NetL3_1: L3.1 U5.3(SW)
NetL4_1: L4.1 U6.3(SW)
NetL5_1: L5.1 U8.3(SW)
NetR2_1: R2.1 R3.2 U3.5(FB)
NetR4_1: R4.1 R5.2
NetR5_1: R5.1 R6.2 U4.5(FB)
NetR7_1: R7.1 R8.2
NetR8_1: R8.1 R9.2 U5.5(FB)
NetR10_1: R10.1 R11.2 U6.5(FB)
NetR20_1: R20.1 R21.2
NetR21_1: R21.1 R22.2 U8.5(FB)

Not connected (* = marked no-connect by the designer): J1 A6(Dp1)* A7(Dn1)* A8(SBU1)* B6(Dp2)* B7(Dn2)* B8(SBU2)*

### Library data of the parts
C8-C34 = C
J1 = CMP-04767-000028-1: CONN RCP USB2.0 TYP C 24P SMD RA
L1-L5 = L-CD
R2-R11 R20-R24 = R
U3-U6 U8 = CMP-04918-000387-1: IC REG BUCK ADJ 2A SOT23-5; Min Input Voltage: 2.5V; Output Configuration: Positive; Synchronous Rectifier: Yes; Min Output Voltage: 600mV; Output Type: Adjustable; Max Input Voltage: 5.5V; Switching Frequency: 1.5MHz; Packaging: Cut Tape; RoHS Compliant: Yes; Output Current: 2A; Max Output Voltage: 5.5V; Case/Package: SOT-23-5; Min Operating Temperature: -40°C; Max Operating Temperature: 125°C; Mount: Surface Mount

## Sheet Data_Collector.SchDoc
size A3; SheetNumber: 5; SheetTotal: 5

## Nets that join several sheets
3V3: FPGA_Banks (6 pins), FPGA_PowerConnection (10 pins), FPGA_PSIO (R15.1 U7.8 Y1.4), Power_Supply (6 pins)
GND: FPGA_Banks (6 pins), FPGA_PowerConnection (61 pins), FPGA_PSIO (33 pins), Power_Supply (45 pins)
VCCAUX: FPGA_PowerConnection (14 pins), Power_Supply (6 pins)
VCCINT: FPGA_PowerConnection (11 pins), Power_Supply (6 pins)
VCCPINT: FPGA_PowerConnection (6 pins), Power_Supply (6 pins)
VMEM: FPGA_PowerConnection (10 pins), FPGA_PSIO (26 pins), Power_Supply (8 pins)
SRST: FPGA_Banks (JP1.8 U1.L6), FPGA_PSIO (U1.B10)